# EAGLE design revA (EAGLE 7.4.0)
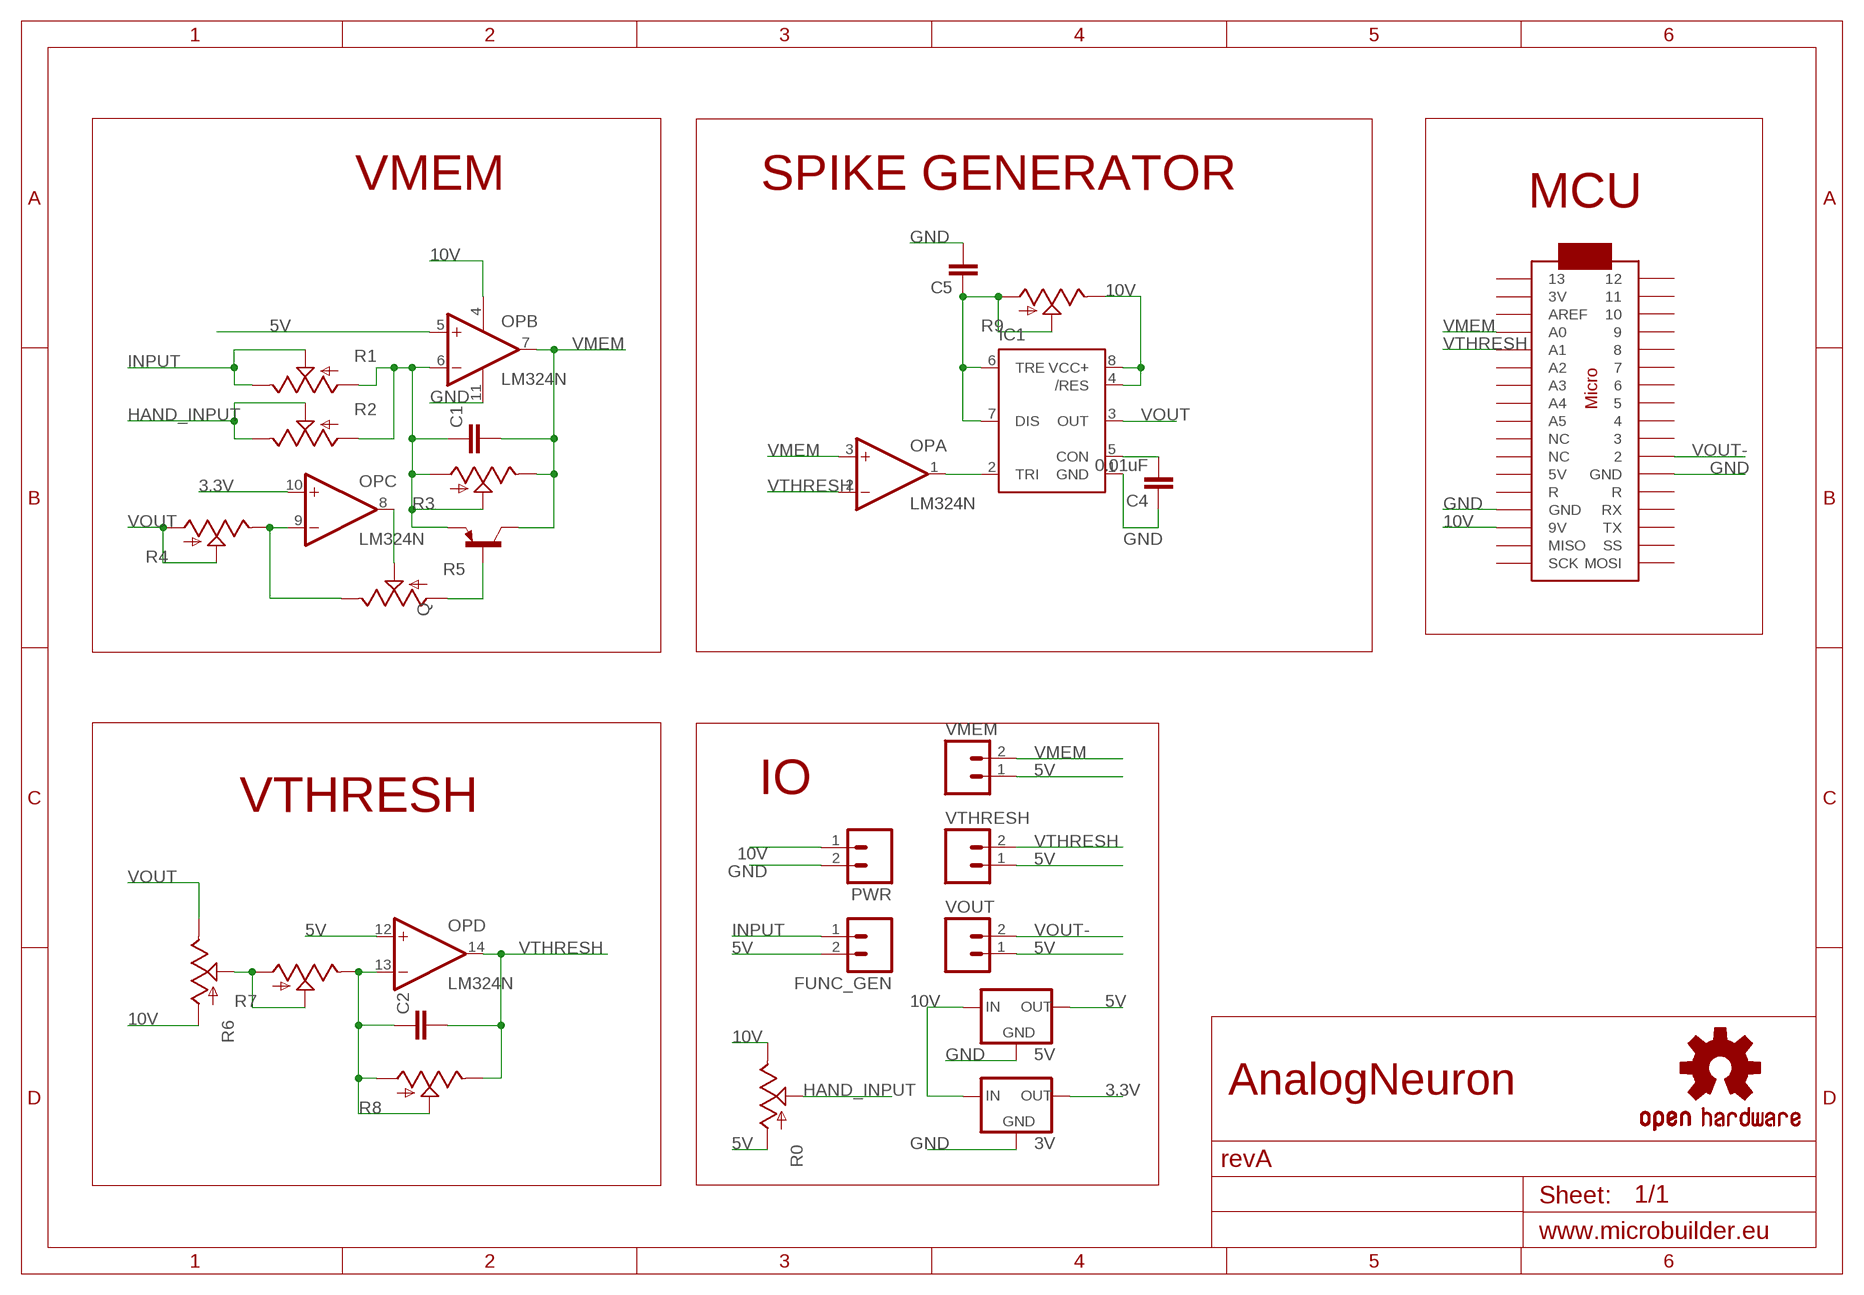
[diagram p0: schematic, sheet 1]

## Parts
3V  78LXX  [78LXX]
5V  78LXX  [78LXX]
C1  CAPPTH1  [CAP-PTH-5MM]
C2  CAPPTH1  [CAP-PTH-5MM]
C4  0.01uF  CAPPTH1  [CAP-PTH-5MM]
C5  CAPPTH1  [CAP-PTH-5MM]
FUNC_GEN  M023.5MM  [SCREWTERMINAL-3.5MM-2]
IC1  NE555KIT  [DIP08-KIT]
LOGO1  OSHW-LOGOL-TOP  [OSHW_LOGO_L_TOP]
OP  LM324N  [DIL14]
PWR  M023.5MM  [SCREWTERMINAL-3.5MM-2]
Q  2N3906-PNP-TO92-EBC  [TO92-EBC]
R0  POT  [ALPS_POT]
R1  POT  [ALPS_POT]
R2  POT  [ALPS_POT]
R3  POT  [ALPS_POT]
R4  POT  [ALPS_POT]
R5  POT  [ALPS_POT]
R6  POT  [ALPS_POT]
R7  POT  [ALPS_POT]
R8  POT  [ALPS_POT]
R9  POT  [ALPS_POT]
U$1  ARDUINOMICRO  [ARDUINOMICRO]
VMEM  M023.5MM  [SCREWTERMINAL-3.5MM-2]
VOUT  M023.5MM  [SCREWTERMINAL-3.5MM-2]
VTHRESH  M023.5MM  [SCREWTERMINAL-3.5MM-2]

## Nets
2: C1.1 OP.6(B:-IN) Q.E R1.P$3(A) R2.P$3(A) R3.P$2(S) R3.P$3(A)
3.3V: 3V.OUT OP.10(C:+IN)
5V: 5V.OUT FUNC_GEN.2 OP.5(B:+IN) OP.12(D:+IN) R0.P$3(A) VMEM.1 VOUT.1 VTHRESH.1
10V: 3V.IN 5V.IN IC1.4(/RES) IC1.8(VCC+) OP.4(P:V+) PWR.1 R0.P$1(E) R6.P$3(A) R9.P$1(E) U$1.P$20(9V)
CON: C4.2 IC1.5(CON)
GND: 3V.GND 5V.GND C4.1 C5.2 IC1.1(GND) OP.11(P:V-) PWR.2 U$1.P$12(GND) U$1.P$21(GND)
HAND_INPUT: R0.P$2(S) R2.P$1(E) R2.P$2(S)
INPUT: FUNC_GEN.1 R1.P$1(E) R1.P$2(S)
N$1: C5.1 IC1.6(TRE) IC1.7(DIS) R9.P$2(S) R9.P$3(A)
N$2: Q.B R5.P$3(A)
N$4: OP.9(C:-IN) R4.P$1(E) R5.P$1(E)
N$9: C2.1 OP.13(D:-IN) R7.P$1(E) R8.P$2(S) R8.P$3(A)
R7: R6.P$2(S) R7.P$2(S) R7.P$3(A)
TRI: IC1.2(TRI) OP.1(A:OUT)
VMEM: C1.2 OP.3(A:+IN) OP.7(B:OUT) Q.C R3.P$1(E) U$1.P$31(A0) VMEM.2
VOUT: IC1.3(OUT) R4.P$2(S) R4.P$3(A) R6.P$1(E)
VOUT-: OP.8(C:OUT) R5.P$2(S) U$1.P$11 VOUT.2
VTHRESH: C2.2 OP.2(A:-IN) OP.14(D:OUT) R8.P$1(E) U$1.P$30(A1) VTHRESH.2
Unconnected: U$1.P$1 U$1.P$2 U$1.P$3 U$1.P$4 U$1.P$5 U$1.P$6 U$1.P$7 U$1.P$8 U$1.P$9 U$1.P$10 U$1.P$13(R) U$1.P$14(RX) U$1.P$15(TX) U$1.P$16(SS) U$1.P$17(MOSI) U$1.P$18(SCK) U$1.P$19(MISO) U$1.P$22(R) U$1.P$23(5V) U$1.P$24(NC) U$1.P$25(NC) U$1.P$26(A5) U$1.P$27(A4) U$1.P$28(A3) U$1.P$29(A2) U$1.P$32(AREF) U$1.P$33(3V) U$1.P$34

## Notes on the sheet
- VMEM | SPIKE GENERATOR
- MCU
- IO
- VTHRESH
- AnalogNeuron

## Library data of the parts
3V 5V = v-reg:78LXX: VOLTAGE REGULATOR
C1 C2 C4 C5 = SparkFun-Passives:CAP: Capacitor Standard 0603 ceramic capacitor, and 0.1" leaded capacitor.
FUNC_GEN PWR VMEM VOUT VTHRESH = SparkFun-Connectors:M02: Standard 2-pin 0.1" header. Use with - straight break away headers ( PRT-00116) - right angle break away headers (PRT-00553) - swiss pins (PRT-00743) - machine pins (PRT-00117) - female headers (PRT-00115) Molex polarized connector foot print use with: PRT-08233 with associated crimp pins and housings. 2.54_SCREWTERM for use with PRT-10571. 3.5mm Screw Terminal footprints for PRT-08084 5mm Screw Terminal footprints for use with PRT-08432; PROD_ID: CONN-08399
IC1 = SparkFun-AnalogIC:NE555: General purpose bipolar Timer; PROD_ID: IC-11930
LOGO1 = SparkFun-Aesthetics:OSHW-LOGO: Open Source Hardware Logo This logo indicates the piece of hardware it is found on incorporates a OSHW license and/or adheres to the definition of open source hardware found here: http://freedomdefined.org/OSHW
OP = linear:LM324: OP AMP
Q = transistor-neu-to92:*-PNP-: PNP Transistror
R0 R1-R9 = SparkFun-Electromechanical:POT; PROD_ID: RES-09177
U$1 = adafruit:ARDUINOMICRO

## Board
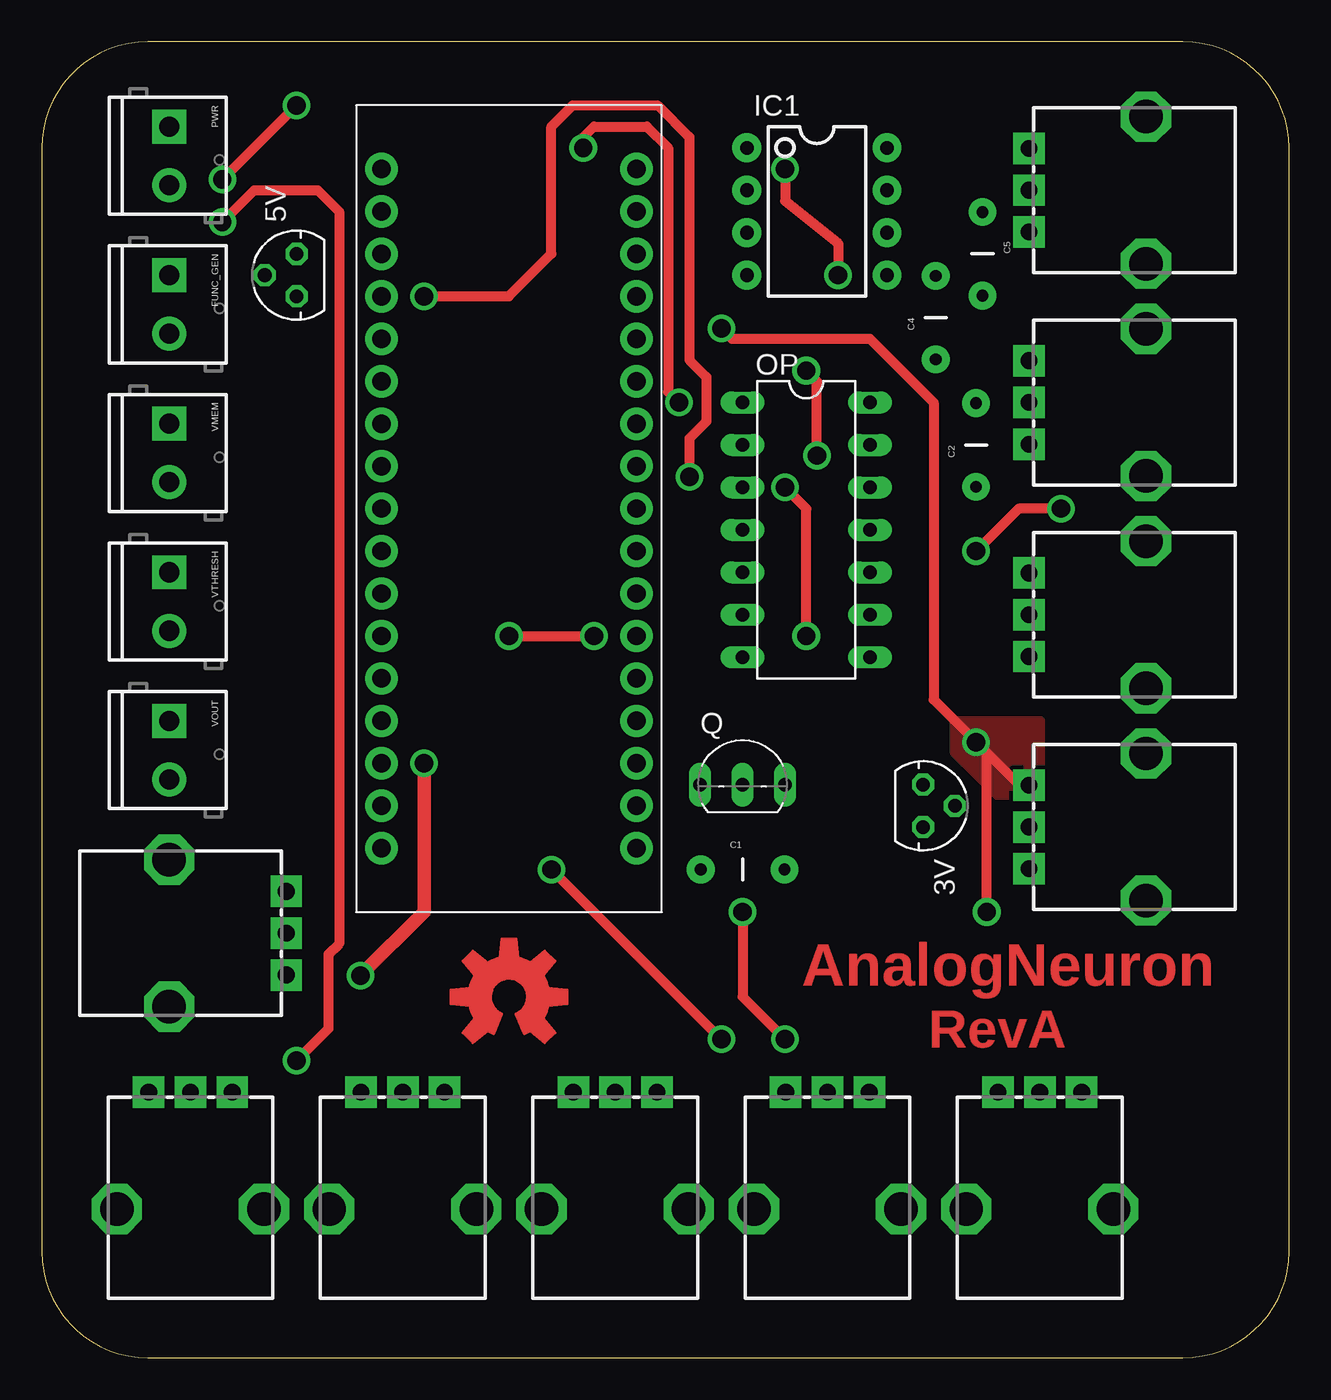
[diagram p1: board, top side]
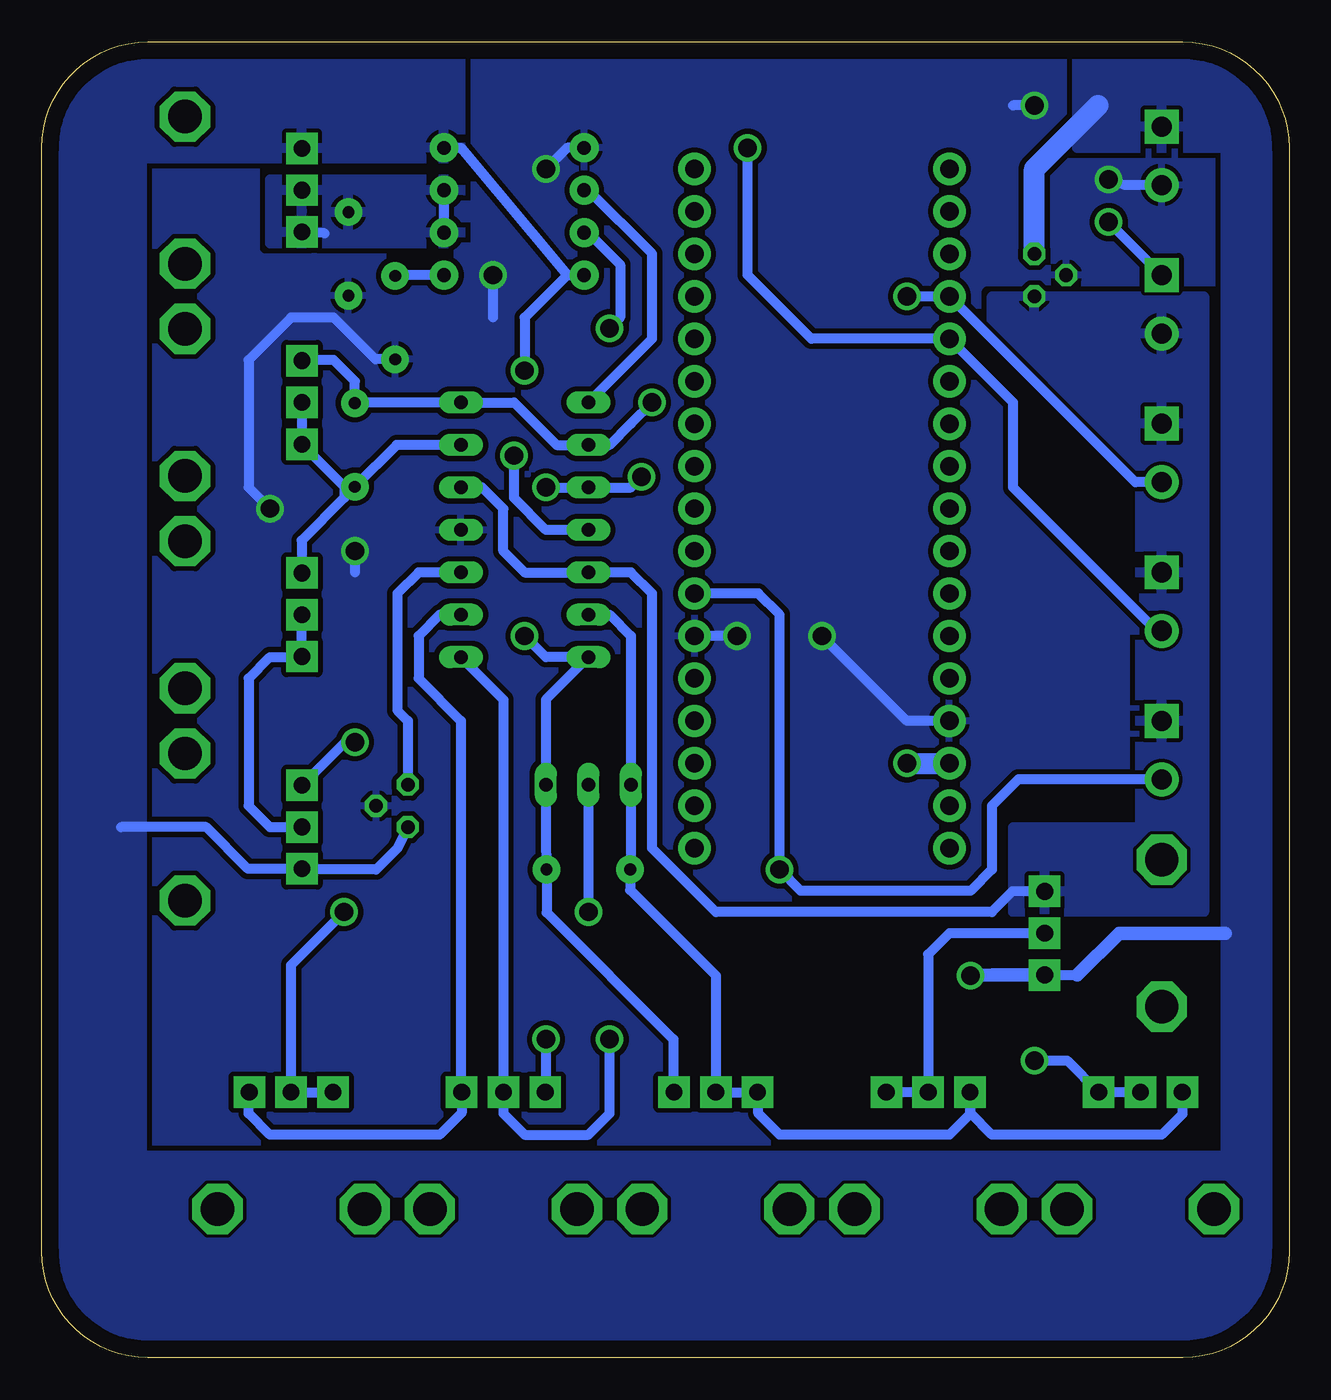
[diagram p2: board, bottom side, seen from below]

Size 74.6 x 78.73 mm. Coordinates in mm from the lower left corner, seen from the top.
Outline: 0,72.38 0,6.35 arc90 6.35,0 68.25,0 arc90 74.6,6.35 74.6,72.38 arc90 68.25,78.73 6.35,78.73 arc90 0,72.38
Copper layers (1*16): Top 0.035mm / dielectric 1.5mm / Bottom 0.035mm
Design rules "default": minimum track width 10mil, minimum drill 24mil, track to track 8mil, track to pad 8mil, pad to pad 8mil, via to via 8mil, smd to smd 8mil, copper to edge 40mil, drill to drill 8mil, minimum pad ring 10mil, minimum via ring 8mil, stop-mask expansion 4mil, vias tented up to drill 0mil, thermal gap 10mil

### Footprints (pad centres in the part's own frame; a part is rotated, then mirrored left to right if it is on the bottom)
78LXX = drill 0.813 octagon: GND 0,1.905; IN 1.27,0; OUT -1.27,0
CAP-PTH-5MM = drill 0.7 pad 1.651: 1 -2.5,0; 2 2.5,0
SCREWTERMINAL-3.5MM-2 = drill 1.2 pad 2.032 square: 1 0,0 | drill 1.2 pad 2.032: 2 3.5,0
DIP08-KIT = drill 0.813 pad 1.727: 1 -3.81,-4.191; 2 -1.27,-4.191; 3 1.27,-4.191; 4 3.81,-4.191; 5 3.81,4.191; 6 1.27,4.191; 7 -1.27,4.191; 8 -3.81,4.191
DIL14 = drill 0.813 long: 1 -7.62,-3.81; 2 -5.08,-3.81; 3 -2.54,-3.81; 4 0,-3.81; 5 2.54,-3.81; 6 5.08,-3.81; 7 7.62,-3.81; 8 7.62,3.81; 9 5.08,3.81; 10 2.54,3.81; 11 0,3.81; 12 -2.54,3.81; 13 -5.08,3.81; 14 -7.62,3.81
TO92-EBC = drill 0.813 long: B 0,-1.27; C 2.54,-1.27; E -2.54,-1.27
ALPS_POT = drill 1 pad 1.88 square: P$1 7,-2.5; P$2 7,0; P$3 7,2.5 | drill 2 octagon: P$4 0,-4.4; P$5 0,4.4
ARDUINOMICRO = drill 1.1 pad 1.93: P$1 -20.32,7.62; P$2 -17.78,7.62; P$3 -15.24,7.62; P$4 -12.7,7.62; P$5 -10.16,7.62; P$6 -7.62,7.62; P$7 -5.08,7.62; P$8 -2.54,7.62; P$9 0,7.62; P$10 2.54,7.62; P$11 5.08,7.62; P$12 12.7,-7.62; P$13 10.16,-7.62; P$14 12.7,7.62; P$15 15.24,7.62; P$16 17.78,7.62; P$17 20.32,7.62; P$18 20.32,-7.62; P$19 17.78,-7.62; P$20 15.24,-7.62; P$21 7.62,7.62; P$22 10.16,7.62; P$23 7.62,-7.62; P$24 5.08,-7.62; P$25 2.54,-7.62; P$26 0,-7.62; P$27 -2.54,-7.62; P$28 -5.08,-7.62; P$29 -7.62,-7.62; P$30 -10.16,-7.62; P$31 -12.7,-7.62; P$32 -15.24,-7.62; P$33 -17.78,-7.62; P$34 -20.32,-7.62

### Placement (x,y rotation side)
3V  52.7,33.02 270 top
5V  15.24,64.77 90 top
C1  41.91,29.21 0 top
C2  55.88,54.61 90 top
C4  53.47,62.23 90 top
C5  56.26,66.04 270 top
FUNC_GEN  7.62,64.77 270 top
IC1  46.35,68.58 270 top
LOGO1  27.94,21.59 0 top
OP  45.72,49.53 270 top
PWR  7.62,73.66 270 top
Q  41.91,35.56 0 top
R0  7.62,25.4 0 top
R1  8.89,8.89 90 top
R2  21.59,8.89 90 top
R3  34.29,8.89 90 top
R4  59.69,8.89 90 top
R5  46.99,8.89 90 top
R6  66.04,31.75 180 top
R7  66.04,44.45 180 top
R8  66.04,57.15 180 top
R9  66.04,69.85 180 top
U$1  27.94,50.8 270 top
VMEM  7.62,55.88 270 top
VOUT  7.62,38.1 270 top
VTHRESH  7.62,46.99 270 top

### Tracks (layer width: path | path; a pad name or v marks a point on that pad's centre or on a via)
2
  Bottom 0.61: OP.6 40.64,44.45 39.37,43.18 Q.E 39.37,29.25 C1.1 39.41,27.98 34.29,22.86 R3.P$2 R3.P$3 31.75,15.85 31.75,14.61 30.48,13.34 20.32,13.34 19.09,14.57 R2.P$3 19.05,15.85 19.05,14.61 17.78,13.34 7.62,13.34 6.39,14.57 R1.P$3
3.3V
  Bottom 0.61: OP.10 52.07,46.99 53.34,45.72 53.34,38.73 52.7,38.1 3V.OUT
5V
  Bottom 0.61: OP.12 48.26,52.07 46.99,50.8 46.99,48.26 45.72,46.99 OP.5 39.37,46.99 38.1,45.72 38.1,30.48 34.29,26.67 17.78,26.67 16.55,27.9 R0.P$3
  pour Bottom: 17.78,63.5 5.08,63.5 5.08,26.67 16.51,26.67 16.51,31.75 8.89,31.75 8.89,53.34 17.78,53.34
10V  (via drill 1.1)
  Top 0.61: v46.35,53.98 46.35,58.42 v45.72,59.05
  Top 0.813: v19.05,22.86 22.86,26.67 v22.86,35.56
  Bottom 0.61: 69.85,31.75 64.77,31.75 62.27,29.25 R6.P$3 59,29.21 54.61,29.21 53.34,30.48 3V.IN | R0.P$1 12.66,22.9 | IC1.8 49.53,72.39 43.18,64.77 | 43.18,64.77 IC1.4 41.91,64.52 | OP.4 44.45,49.53 46.35,51.44 v46.35,53.98 | 43.18,64.77 45.72,62.23 v45.72,59.05
  Bottom 0.813: 12.66,22.9 10.16,25.4 3.81,25.4 | R0.P$1 17.74,22.9 v19.05,22.86
  Bottom 1.27: v22.86,35.56 U$1.P$20 | 5V.IN 15.24,71.12 11.43,74.93
  pour Bottom (rank 3): 0,81.28 12.7,81.28 12.7,72.39 3.81,72.39 3.81,12.07 68.58,12.07 68.58,81.28 82.55,81.28 82.55,-5.08 0,-5.08
  pour Bottom (isolate 0.305, rank 2): 74.93,71.76 49.53,71.76 49.53,78.74 74.93,78.74
CON
  Bottom 0.61: IC1.5 52.79,64.77 C4.2
GND  (via drill 1.1)
  Top 0.61: v10.8,70.48 v15.24,74.93 | v60.96,50.8 58.42,50.8 v55.88,48.26 | v27.94,43.18 v33.02,43.18 | v44.45,71.12 44.45,69.22 47.62,66.68 v47.62,64.77
  Bottom 0.61: PWR.2 9.85,70.16 v10.8,70.48 | v15.24,74.93 16.51,74.93 | C4.1 54.65,59.73 57.15,62.23 59.69,62.23 62.23,59.69 62.23,52.07 v60.96,50.8 | v55.88,48.26 55.88,46.99 | U$1.P$12 22.86,38.1 v27.94,43.18 | v33.02,43.18 U$1.P$21 | IC1.1 43.18,72.39 v44.45,71.12 | v47.62,64.77 47.62,62.23
  pour Bottom (isolate 0.305, rank 6): -1.27,80.01 93.98,80.01 93.98,2.54 -2.54,0
HAND_INPUT
  Bottom 0.61: R0.P$2 20.32,25.4 21.59,24.13 R2.P$2 R2.P$1
INPUT  (via drill 1.1)
  Top 0.61: v10.8,67.95 12.7,69.85 16.51,69.85 17.78,68.58 17.78,24.77 17.14,24.13 17.14,19.68 v15.24,17.78
  Bottom 0.61: FUNC_GEN.1 v10.8,67.95 | v15.24,17.78 13.28,17.78 R1.P$1 R1.P$2
N$1
  Bottom 0.61: 57.69,67.27 R9.P$3 | IC1.7 IC1.6
  pour Bottom (isolate 0.305): 49.53,70.48 60.96,70.48 60.96,66.68 49.53,66.68
N$2  (via drill 1.1)
  Top 0.61: v41.91,26.67 41.91,21.59 v44.45,19.05
  Bottom 0.61: Q.B v41.91,26.67 | v44.45,19.05 44.45,15.93 R5.P$3
N$4
  Bottom 0.61: R4.P$1 62.23,15.85 62.23,14.61 60.96,13.34 50.8,13.34 49.49,14.64 R5.P$1 49.53,15.93 49.53,38.1 52.07,40.64 52.07,43.18 50.8,44.45 OP.9
N$9
  Bottom 0.61: OP.13 53.38,54.61 C2.1 56.5,52.11 | 56.5,52.11 R8.P$3 R8.P$2 | 56.5,52.11 56.5,51.45 59.05,48.89 59.05,46.96 R7.P$1
R7
  Bottom 0.61: R7.P$3 59.65,41.95 | R6.P$2 60.96,31.75 62.23,33.02 62.23,40.64 60.96,41.91 59.08,41.91 R7.P$3 | R7.P$3 R7.P$2
TRI
  Bottom 0.61: OP.1 38.1,60.96 38.1,66.04 41.91,69.85 IC1.2
VMEM  (via drill 1.1)
  Top 0.61: v45.72,43.18 45.72,50.8 v44.45,52.07 | v22.86,63.5 27.94,63.5 30.48,66.04 30.48,73.66 31.75,74.93 36.83,74.93 38.73,73.03 38.73,59.69 39.75,58.67 39.75,56.01 38.73,54.99 v38.73,52.7
  Bottom 0.61: R3.P$1 36.83,15.93 36.83,19.05 44.41,26.63 C1.2 44.45,30.52 Q.C 44.45,39.37 OP.7 44.45,41.91 v45.72,43.18 | VMEM.2 9.2,52.38 U$1.P$31 v22.86,63.5 | v44.45,52.07 OP.3 39.37,52.07 v38.73,52.7
VOUT  (via drill 1.1)
  Top 0.61: v40.64,61.59 41.27,60.96 49.53,60.96 53.34,57.15 53.34,39.37 v55.88,36.83 | v55.88,36.83 58.42,34.29 59.18,34.29 | v56.52,26.67 56.52,36.2 v55.88,36.83
  Bottom 0.61: IC1.3 41.91,67.31 40.01,65.41 40.01,62.23 v40.64,61.59 | v55.88,36.83 56.46,36.83 R6.P$1 | R4.P$3 R4.P$2 59.69,23.49 v56.52,26.67
  pour Top: 55.88,38.1 59.69,38.1 59.69,33.66 57.15,33.66 55.88,34.92 54.61,36.2 54.61,38.1
VOUT-  (via drill 1.1)
  Top 0.61: v40.64,19.05 v30.48,29.21
  Bottom 0.61: OP.8 46.99,39.37 R5.P$2 46.99,14.61 45.72,13.34 41.91,13.34 40.64,14.61 v40.64,19.05 | VOUT.2 16.2,34.6 17.78,33.02 17.78,29.21 19.05,27.94 29.21,27.94 v30.48,29.21 30.48,31.75 30.48,44.45 31.75,45.72 U$1.P$11
VTHRESH  (via drill 1.1)
  Top 0.61: v32.38,72.39 32.38,73.03 33.02,73.66 36.2,73.66 37.46,72.39 37.46,57.78 v38.1,57.15
  Bottom 0.61: VTHRESH.2 7.62,43.18 16.51,52.07 16.51,57.15 U$1.P$30 28.57,60.96 32.38,64.77 v32.38,72.39 | R8.P$1 59,59.69 57.15,59.69 55.88,58.42 C2.2 55.84,57.15 OP.14 46.35,57.15 43.81,54.61 OP.2 40.64,54.61 39.37,55.88 v38.1,57.15

### Text on the board
Top: AnalogNeuron | RevA